# Altium schematic sheet Top_Level_3.SchDoc
size A
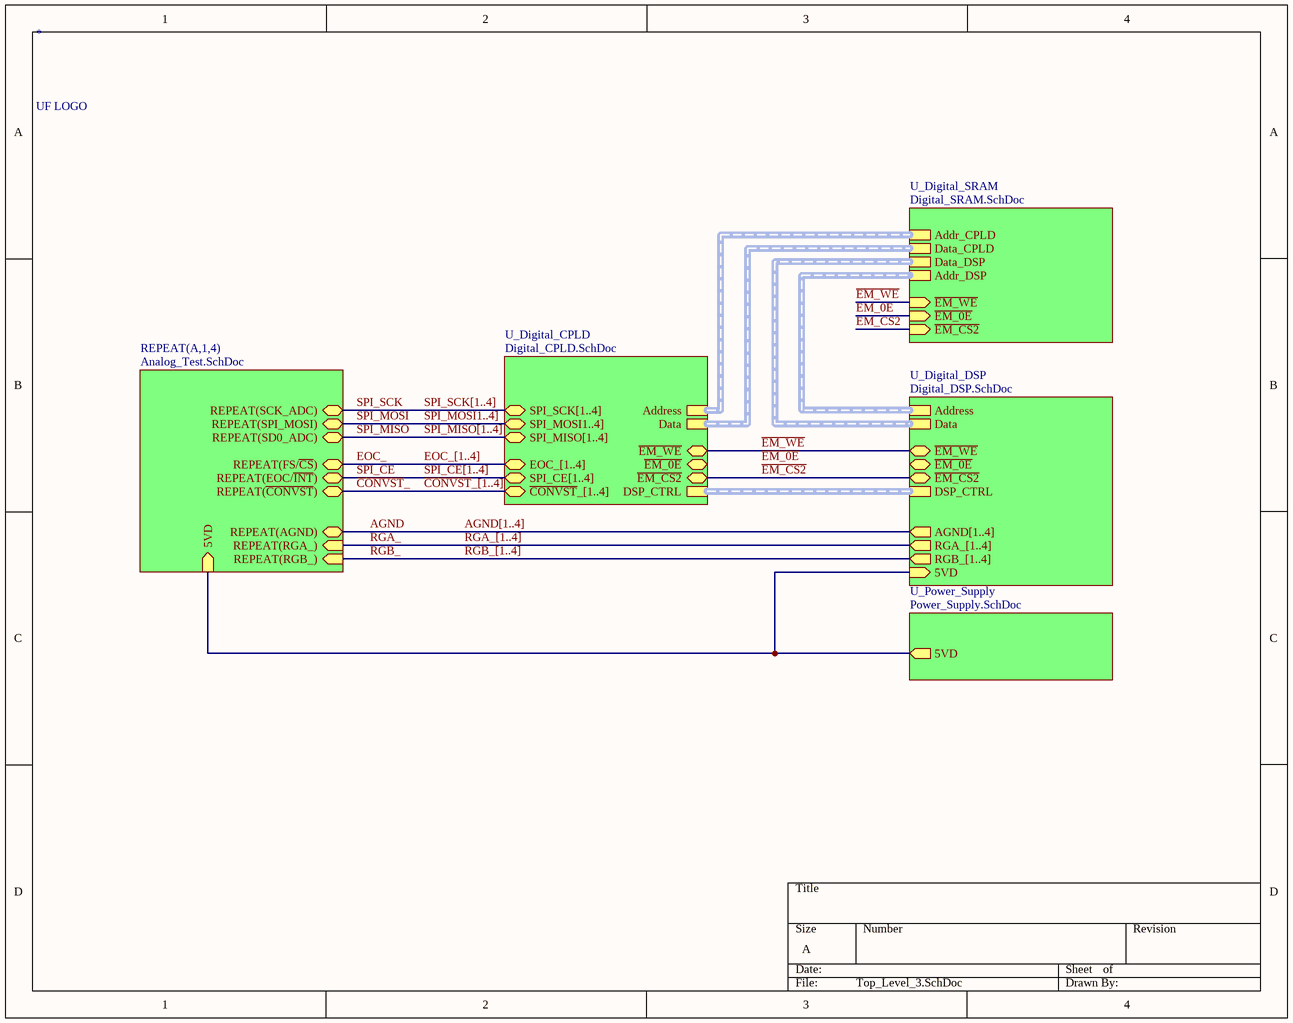
[diagram p0: Top_Level_3.SchDoc]

## Parts
*  UF LOGO  [UF LOGO-1000]
MIL  MIL LOGO  [MIL LOGO - 500]  (value not drawn)

## Sub-sheets
REPEAT(A,1,4) = Analog_Test.SchDoc: 5VD (in), REPEAT(RGA_) (in), REPEAT(RGB_) (in), REPEAT(SCK_ADC) (bidir), REPEAT(SD0_ADC) (bidir), REPEAT(FS/~{CS}) (bidir), REPEAT(~{CONVST}) (bidir), REPEAT(EOC/~{INT}) (bidir), REPEAT(AGND) (bidir), REPEAT(SPI_MOSI) (bidir)
U_Digital_CPLD = Digital_CPLD.SchDoc: Address (harness Address), Data (harness Data), ~{EM_0E} (bidir), ~{EM_CS2} (bidir), ~{EM_WE} (bidir), DSP_CTRL (harness DSP_CTRL), SPI_SCK[1..4], EOC_[1..4], SPI_MOSI1..4], SPI_MISO[1..4], SPI_CE[1..4], ~{CONVST}_[1..4]
U_Digital_DSP = Digital_DSP.SchDoc: 5VD (in), DSP_CTRL (harness DSP_CTRL), Address (harness Address), Data (harness Data), RGA_[1..4] (out), RGB_[1..4] (out), AGND[1..4] (out), ~{EM_WE} (bidir), ~{EM_0E} (bidir), ~{EM_CS2} (bidir)
U_Digital_SRAM = Digital_SRAM.SchDoc: ~{EM_CS2} (in), ~{EM_WE} (in), Addr_CPLD (harness Addr_CPLD), Data_CPLD (harness Data_CPLD), ~{EM_0E} (in), Addr_DSP (harness Addr_DSP), Data_DSP (harness Data_CPLD)
U_Power_Supply = Power_Supply.SchDoc: 5VD (out)

## Nets
AGND: sheet REPEAT(A,1,4)/REPEAT(AGND)
~{CONVST}_: sheet REPEAT(A,1,4)/REPEAT(~{CONVST})
~{EM_0E}: sheet U_Digital_SRAM/~{EM_0E}
~{EM_CS2}: sheet U_Digital_DSP/~{EM_CS2}, sheet U_Digital_CPLD/~{EM_CS2}, sheet U_Digital_SRAM/~{EM_CS2}
~{EM_WE}: sheet U_Digital_DSP/~{EM_WE}, sheet U_Digital_CPLD/~{EM_WE}, sheet U_Digital_SRAM/~{EM_WE}
EOC_: sheet REPEAT(A,1,4)/REPEAT(FS/~{CS})
RGA_: sheet REPEAT(A,1,4)/REPEAT(RGA_)
RGB_: sheet REPEAT(A,1,4)/REPEAT(RGB_)
SPI_CE: sheet REPEAT(A,1,4)/REPEAT(EOC/~{INT})
SPI_MISO: sheet REPEAT(A,1,4)/REPEAT(SD0_ADC)
SPI_MOSI: sheet REPEAT(A,1,4)/REPEAT(SPI_MOSI)
SPI_SCK: sheet REPEAT(A,1,4)/REPEAT(SCK_ADC)
(unnamed): sheet U_Digital_DSP/5VD, sheet REPEAT(A,1,4)/5VD, sheet U_Power_Supply/5VD

## Buses and harness runs
bus AGND[1..4] = sheet U_Digital_DSP/AGND[1..4]
bus EOC_[1..4] = sheet U_Digital_CPLD/EOC_[1..4]
bus RGA_[1..4] = sheet U_Digital_DSP/RGA_[1..4]
bus RGB_[1..4] = sheet U_Digital_DSP/RGB_[1..4]
bus SPI_CE[1..4] = sheet U_Digital_CPLD/SPI_CE[1..4]
bus SPI_MISO[1..4] = sheet U_Digital_CPLD/SPI_MISO[1..4]
bus SPI_MOSI1..4] = sheet U_Digital_CPLD/SPI_MOSI1..4]
bus SPI_SCK[1..4] = sheet U_Digital_CPLD/SPI_SCK[1..4]
bus ~{CONVST}_[1..4] = sheet U_Digital_CPLD/~{CONVST}_[1..4]
harness sheet U_Digital_CPLD/Address = sheet U_Digital_SRAM/Addr_CPLD
harness sheet U_Digital_CPLD/Data = sheet U_Digital_SRAM/Data_CPLD
harness sheet U_Digital_CPLD/DSP_CTRL = sheet U_Digital_DSP/DSP_CTRL
harness sheet U_Digital_DSP/Address = sheet U_Digital_SRAM/Addr_DSP
harness sheet U_Digital_DSP/Data = sheet U_Digital_SRAM/Data_DSP

## Notes on the sheet
- Labels drawn without touching a wire or pin: ~{EM_0E}